# Altium schematic sheet Motor_Driver.SchDoc
size A; SheetNumber: 4; SheetTotal: 6
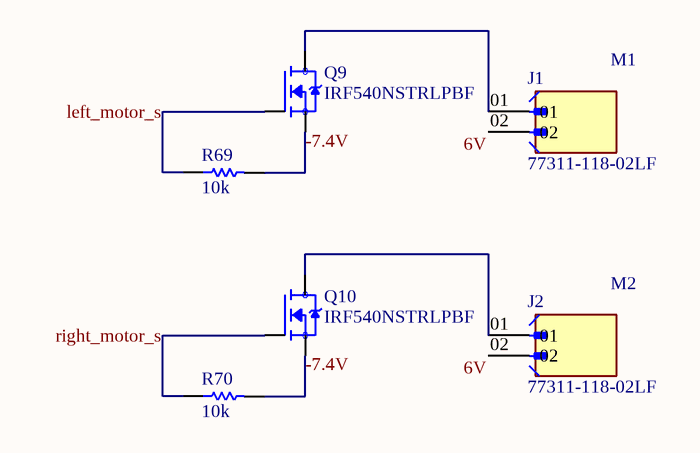
[diagram p0: Motor_Driver.SchDoc]

## Parts
J1  77311-118-02LF  [AMPHENOL_77311-118-02LF]
J2  77311-118-02LF  [AMPHENOL_77311-118-02LF]
Q9  IRF540NSTRLPBF  [TRANS_IRF540NSTRLPBF]
Q10  IRF540NSTRLPBF  [TRANS_IRF540NSTRLPBF]
R69  10k  [RESC2013X60X35NL10T20]
R70  10k  [RESC2013X60X35NL10T20]

## Nets
6V: J1.02 J2.02
-7.4V: Q9.3(S) Q10.3(S) R69.2 R70.2
left_motor_s: Q9.1(G) R69.1
right_motor_s: Q10.1(G) R70.1
NetJ1_01: J1.01 Q9.2(D)
NetJ2_01: J2.01 Q10.2(D)

## Notes on the sheet
- M1
- M2

## Library data of the parts
J1 J2 = 77311-118-02LF: Conn Rect UnshroudedHdr 2Cnts ThruHole BergStik 2.54mmPin-Spng Vert SingleRow | Amphenol FCI (Amphenol CS) 77311-118-02LF; MF: Amphenol ICC; SnapEDA_Link: https://www.snapeda.com/parts/77311-118-02LF/Amphenol/view-part/?ref=snap; Package: None; Value: *; MP: 77311-118-02LF; Check_prices: https://www.snapeda.com/parts/77311-118-02LF/Amphenol/view-part/?ref=eda
Q9 Q10 = IRF540NSTRLPBF: MOSFET, Power,N-Ch,VDSS 100V,RDS(ON) 44 Milliohms,ID 33A,D2Pak,PD 130W,VGS+/-20V | Infineon IRF540NSTRLPBF; SnapEDA_Link: https://www.snapeda.com/parts/IRF540NSTRLPBF/Infineon/view-part/?ref=snap; Package: D2PAK Infineon; Value: *; MF: Infineon; MP: IRF540NSTRLPBF; Check_prices: https://www.snapeda.com/parts/IRF540NSTRLPBF/Infineon/view-part/?ref=eda
R69 R70 = 10k: Chip Resistor, 10 KOhm, +/- 1%, 0.125 W, -55 to 155 degC, 0805 (2012 Metric), RoHS, Tape and Reel; RC0805FR-0710KL; Manufacturer: Yageo; Voltage Rating: 150 V; Mount: Surface Mount; ComponentLink1Description: Manufacturer URL; ComponentLink2URL: http://www.yageo.com/documents/recent/PYu-RC_Group_51_RoHS_L_04.pdf; Pins: 2; Length: 2 mm; Min Operating Temperature: -55 degC; Height: 0.5 mm; Mounting Technology: Surface Mount; RoHSCompliant: true; REACH SVHC: No SVHC; ComponentLink1URL: http://www.yageo.com/; Max Operating Temperature: 155 degC; PackageReference: 0805; DatasheetVersion: Rev. 4, 02/2016; Package Quantity: 5000; Packaging: Tape and Reel; ComponentLink2Description: Datasheet; PackageDescription: 2-Pin Surface Mounted Device, Body 2 x 1.25 mm